# Altium schematic sheet 5-Pads.SchDoc
size A4
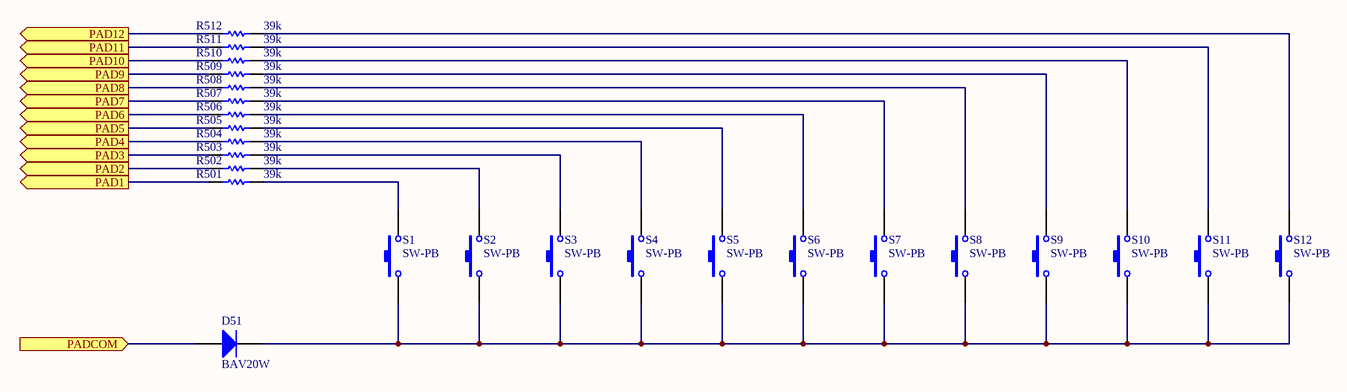
[diagram p0: 5-Pads.SchDoc]

## Parts
D51  BAV20W  [Diode SOD-123]
R501  39k  [RES 1206]
R502  39k  [RES 1206]
R503  39k  [RES 1206]
R504  39k  [RES 1206]
R505  39k  [RES 1206]
R506  39k  [RES 1206]
R507  39k  [RES 1206]
R508  39k  [RES 1206]
R509  39k  [RES 1206]
R510  39k  [RES 1206]
R511  39k  [RES 1206]
R512  39k  [RES 1206]
S1  SW-PB  [PAD]
S2  SW-PB  [PAD]
S3  SW-PB  [PAD]
S4  SW-PB  [PAD]
S5  SW-PB  [PAD]
S6  SW-PB  [PAD]
S7  SW-PB  [PAD]
S8  SW-PB  [PAD]
S9  SW-PB  [PAD]
S10  SW-PB  [PAD]
S11  SW-PB  [PAD]
S12  SW-PB  [PAD]

## Ports
PAD1 (out), PAD2 (out), PAD3 (out), PAD4 (out), PAD5 (out), PAD6 (out), PAD7 (out), PAD8 (out), PAD9 (out), PAD10 (out), PAD11 (out), PAD12 (out), PADCOM (in)

## Nets
PAD1: R501.1 ; port PAD1
PAD2: R502.1 ; port PAD2
PAD3: R503.1 ; port PAD3
PAD4: R504.1 ; port PAD4
PAD5: R505.1 ; port PAD5
PAD6: R506.1 ; port PAD6
PAD7: R507.1 ; port PAD7
PAD8: R508.1 ; port PAD8
PAD9: R509.1 ; port PAD9
PAD10: R510.1 ; port PAD10
PAD11: R511.1 ; port PAD11
PAD12: R512.1 ; port PAD12
PADCOM: D51.1(A) ; port PADCOM
NetD51_2: D51.2(K) S1.1 S2.1 S3.1 S4.1 S5.1 S6.1 S7.1 S8.1 S9.1 S10.1 S11.1 S12.1
NetR501_2: R501.2 S1.2
NetR502_2: R502.2 S2.2
NetR503_2: R503.2 S3.2
NetR504_2: R504.2 S4.2
NetR505_2: R505.2 S5.2
NetR506_2: R506.2 S6.2
NetR507_2: R507.2 S7.2
NetR508_2: R508.2 S8.2
NetR509_2: R509.2 S9.2
NetR510_2: R510.2 S10.2
NetR511_2: R511.2 S11.2
NetR512_2: R512.2 S12.2

## Library data of the parts
D51 = Diode: Default Diode; Fabricant: DIODES INC.; Fournisseur: Farnell; RefFournisseur: 1902417; RefFabricant: BAV20W
R501-R512 = Res1: Resistor; Fabricant: MULTICOMP; Fournisseur: Farnell; RefFabricant: MC0125W1206539K; RefFournisseur: 9337407
S1-S12 = SW-PB: Switch; Fabricant: N/A; Fournisseur: N/A; RefFabricant: N/A; RefFournisseur: N/A